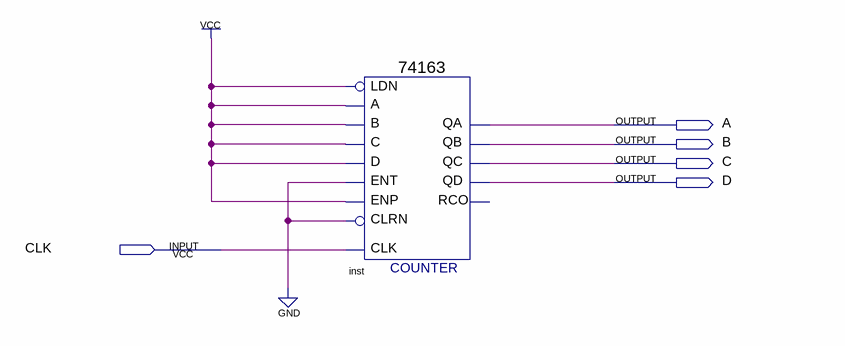
[diagram p0: schematic sheet]
// Quartus schematic SpecialCount.bdf as structural Verilog: 1 symbols, 5 pins
module SpecialCount (
  input  CLK,
  output A,
  output B,
  output C,
  output D
);

  \74163  inst (
    .C(1'b1), .B(1'b1), .A(1'b1), .ENT(1'b0), .D(1'b1), .CLRN(1'b0), .CLK(CLK), .ENP(1'b1), .LDN(1'b1),
    .QA(A), .QB(B), .QC(C), .QD(D));  // open: RCO
endmodule
